# Altium project 电子烟机-KZ-EC06-V1.01.PrjPcb
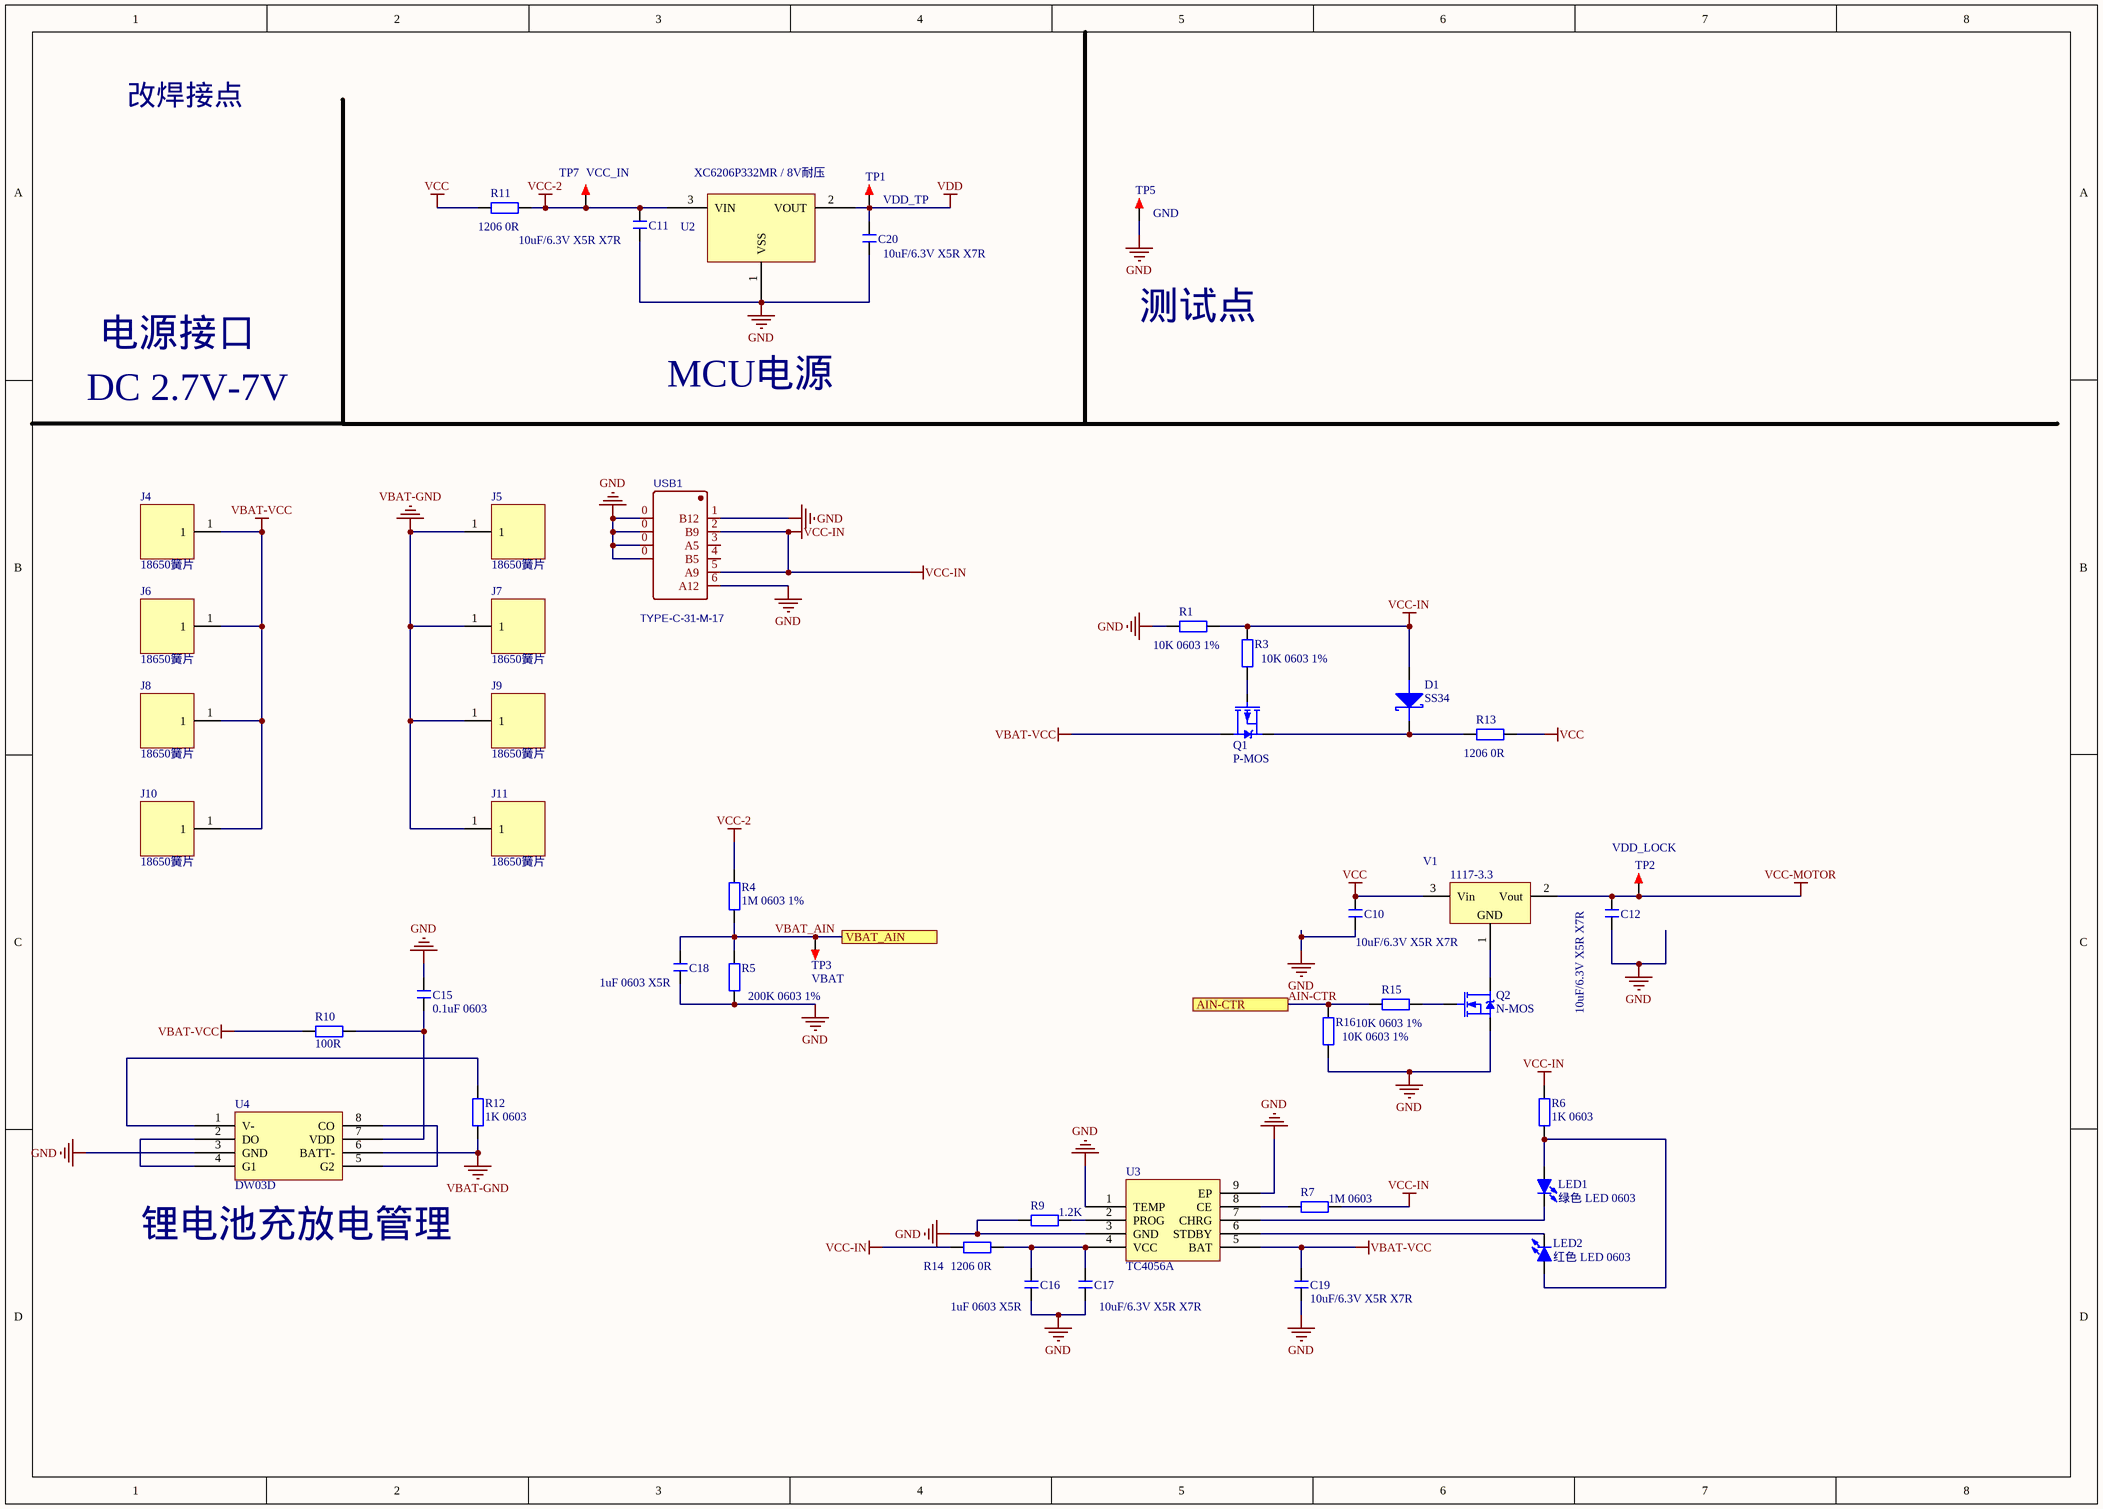
[diagram p0: 电源.SchDoc]
2 sheets, 69 parts. Net scope: flat (ports and power ports of the same name join across sheets).
Board file: BCM-电子烟机-V1.01.PcbDoc
Sheets:
  电源.SchDoc
  主控制器.SchDoc

## Sheet 电源.SchDoc
size A3; Organization: Altium Limited; Address1: L3, 12a Rodborough Rd; Address2: Frenchs Forest; Address3: NSW; Address4: Australia 2086

### Parts
C10  10uF/6.3V X5R X7R  [C 0603]
C11  10uF/6.3V X5R X7R  [C 0603]
C12  10uF/6.3V X5R X7R  [C 0603]
C15  0.1uF 0603  [C 0603]
C16  1uF 0603 X5R  [C 0603]
C17  10uF/6.3V X5R X7R  [C 0603]
C18  1uF 0603 X5R  [C 0603]
C19  10uF/6.3V X5R X7R  [C 0603]
C20  10uF/6.3V X5R X7R  [C 0603]
D1  SS34  [SMA/DO-214AC]
J4  18650簧片  [18650电池簧片]
J5  18650簧片  [18650电池簧片]
J6  18650簧片  [18650电池簧片]
J7  18650簧片  [18650电池簧片]
J8  18650簧片  [18650电池簧片]
J9  18650簧片  [18650电池簧片]
J10  18650簧片  [18650电池簧片]
J11  18650簧片  [18650电池簧片]
LED1  绿色 LED 0603  [LED 0603G]
LED2  红色 LED 0603  [LED 0603G]
Q1  P-MOS  [SOT23]
Q2  N-MOS  [SOT23]
R1  10K 0603 1%  [R 0603]
R3  10K 0603 1%  [R 0603]
R4  1M 0603 1%  [R 0603]
R5  200K 0603 1%  [R 0603]
R6  1K 0603  [R 0603]
R7  1M 0603  [R 0603]
R9  1.2K  [R 0603]
R10  100R  [R 0603]
R11  1206 0R  [R 1206]
R12  1K 0603  [R 0603]
R13  1206 0R  [R 1206]
R14  1206 0R  [R 1206]
R15  10K 0603 1%  [R 0603]
R16  10K 0603 1%  [R 0603]
TP1  VDD_TP  [TEST 1]
TP2  VDD_LOCK  [TEST 1]
TP3  VBAT  [TEST 1]
TP5  GND  [TEST 1]
TP7  VCC_IN  [TEST 1]
U2  XC6206P332MR / 8V耐压  [SOT23-3]
U3  TC4056A  [SOP-8_L4.9-W3.9-P1.27-LS6.0-BL-EP]
U4  DW03D  [TSSOP-8_L4.4-W3.0-P0.65-LS6.4-BL]
USB1  TYPE-C-31-M-17  [USB-TYPE-C-SMD6]
V1  1117-3.3  [SOT223_L]

### Ports
AIN-CTR, VBAT_AIN

### Nets
GND: C10.1 C11.1 C12.1 C15.2 C16.2 C17.2 C18.1 C19.2 C20.1 Q2.S R1.2 R5.1 R9.2 R16.2 TP5.1 U2.1(VSS) U3.1(TEMP) U3.3(GND) U3.9(EP) U4.3(GND) USB1.0 USB1.1(B12) USB1.6(A12)
VBAT-GND: J5.1 J7.1 J9.1 J11.1 R12.1 U4.6(BATT-)
VBAT-VCC: C19.1 J4.1 J6.1 J8.1 J10.1 Q1.D R10.2 U3.5(BAT)
VCC: C10.2 R11.1 R13.2 V1.3(Vin)
VCC-2: C11.2 R4.1 R11.2 TP7.1 U2.3(VIN)
VCC-IN: D1.A R1.1 R3.1 R6.1 R7.1 R14.1 USB1.2(B9) USB1.5(A9)
VCC-MOTOR: C12.2 TP2.1 V1.2(Vout)
VDD: C20.2 TP1.1 U2.2(VOUT)
AIN-CTR: R15.2 R16.1 ; port AIN-CTR
VBAT_AIN: C18.2 R4.2 R5.2 TP3.1 ; port VBAT_AIN
NetC15_1: C15.1 R10.1 U4.7(VDD)
NetC16_1: C16.1 C17.1 R14.2 U3.4(VCC)
NetD1_K: D1.K Q1.S R13.1
NetLED1_1: LED1.1(A) LED2.1(A) R6.2
NetLED1_2: LED1.2(K) U3.7(CHRG)
NetLED2_2: LED2.2(K) U3.6(STDBY)
NetQ1_G: Q1.G R3.2
NetQ2_D: Q2.D V1.1(GND)
NetQ2_G: Q2.G R15.1
NetR7_2: R7.2 U3.8(CE)
NetR9_1: R9.1 U3.2(PROG)
NetR12_2: R12.2 U4.1(V-)
NetU4_2: U4.2(DO) U4.4(G1)
NetU4_5: U4.5(G2) U4.8(CO)

Not connected (* = marked no-connect by the designer): USB1 3(A5) 4(B5)

### Notes on the sheet
- 改焊接点
- 电源接口
- 测试点
- DC 2.7V-7V
- MCU电源
- (near U4) 锂电池充放电管理
- Title
- Size:
- Date:
- A4
- Number:
- Time:
- Revision:
- Sheet
- of
- File:

### Library data of the parts
C10-C12 C15-C20 = C: 无极性贴片电容; 版权归属: 源创客; BOM名称: 无极性贴片电容; 学习资源: www.ooocke.com
D1 = DIODE SCHOTTKY: 肖特基二极管
LED1 LED2 = LED-SMD: 贴片LED; 版权归属: 源创客; BOM名称: 贴片LED; 学习资源: www.ooocke.com
Q1 = P-MOS: P沟道场效应管
Q2 = N-MOS: N沟道场效应管
R1 R3-R7 R9-R16 = R: 贴片电阻; 版权归属: 源创客; BOM名称: 贴片电阻; 学习资源: www.ooocke.com
TP1-TP3 TP5 TP7 = TEST TP: 测试环; 版权归属: 源创客; BOM名称: 测试环; 学习资源: www.ooocke.com
U2 = XC6206P252MR: LDO
U3 = TC4056A: 锂电池充电IC
U4 = DW03D: 充电保护IC
V1 = AMS1117: 三端稳压芯片; BOM名称: 稳压芯片; 版权归属: 源创客; 学习资源: www.ooocke.com

## Sheet 主控制器.SchDoc
size A3; Organization: Altium Limited; Address1: L3, 12a Rodborough Rd; Address2: Frenchs Forest; Address3: NSW; Address4: Australia 2086
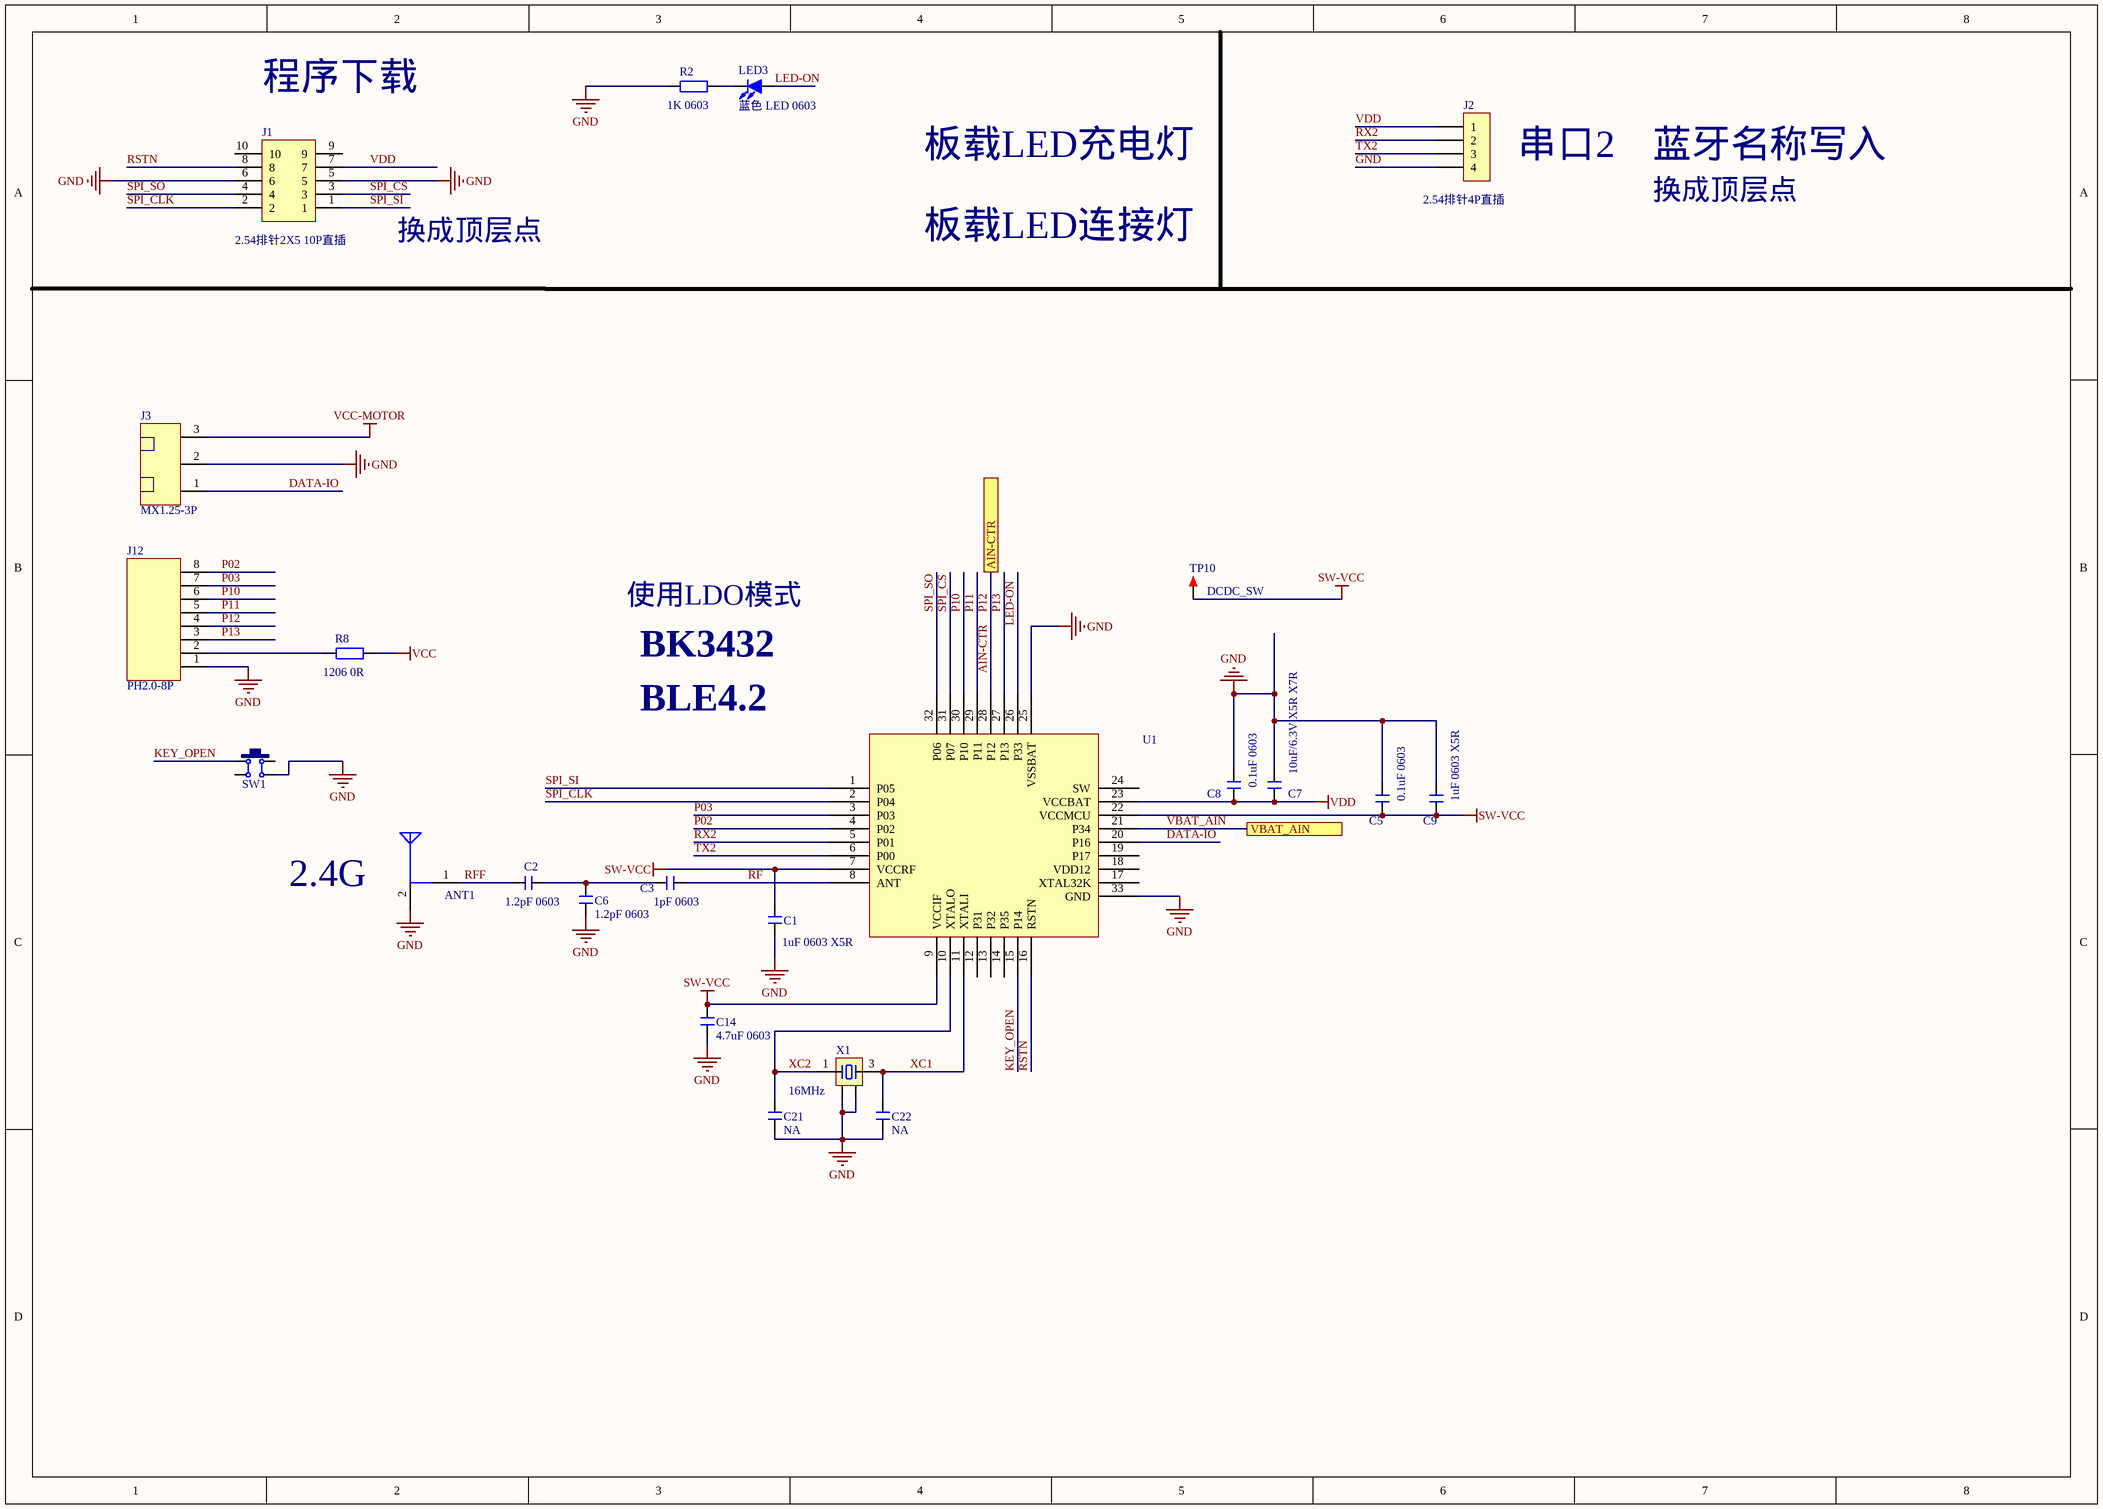
[diagram p1: 主控制器.SchDoc]

### Parts
ANT1  Board_RF  [BK3432-RF-2]  (value not drawn)
C1  1uF 0603 X5R  [C 0603]
C2  1.2pF 0603  [C 0603]
C3  1pF 0603  [C 0603]
C5  0.1uF 0603  [C 0603]
C6  1.2pF 0603  [C 0603]
C7  10uF/6.3V X5R X7R  [C 0603]
C8  0.1uF 0603  [C 0603]
C9  1uF 0603 X5R  [C 0603]
C14  4.7uF 0603  [C 0603]
C21  NA  [C 0603]
C22  NA  [C 0603]
J1  2.54排针2X5 10P直插  [Pin HDR2X5/2.54mm]
J2  2.54排针4P直插  [Pin HDR2.54MM/1X4]
J3  MX1.25-3P  [MX1.25S-3P]
J12  PH2.0-8P  [PH2.0-8P]
LED3  蓝色 LED 0603  [LED 0603G]
R2  1K 0603  [R 0603]
R8  1206 0R  [R 1206]
SW1  6x6x5  [TSW SMD-6*6*4.3]  (value not drawn)
TP10  DCDC_SW  [TEST 1]
U1  BK3432 QFN32  [QFN32]  (value not drawn)
X1  16MHz  [OSC 3225-4P]

### Ports
AIN-CTR, VBAT_AIN

### Nets
GND: C1.1 C5.1 C6.1 C7.1 C8.1 C9.1 C14.1 C21.1 C22.1 J1.5 J1.6 J2.4 J3.2 J12.1 R2.1 SW1.3 U1.25(VSSBAT) U1.33(GND) X1.2 X1.4
SW-VCC: C1.2 C5.2 C9.2 C14.2 TP10.1 U1.7(VCCRF) U1.9(VCCIF) U1.22(VCCMCU)
VCC: R8.2
VCC-MOTOR: J3.3
VDD: C7.2 C8.2 J1.7 J2.1 U1.23(VCCBAT)
AIN-CTR: J12.4 U1.28(P12) ; port AIN-CTR  [also labelled P12]
DATA-IO: J3.1 U1.20(P16)
KEY_OPEN: SW1.1 U1.15(P14)
LED-ON: LED3.1(A) U1.26(P33)
P02: J12.8 U1.4(P02)
P03: J12.7 U1.3(P03)
P10: J12.6 U1.30(P10)
P11: J12.5 U1.29(P11)
P13: J12.3 U1.27(P13)
RF: C3.2 U1.8(ANT)
RFF: ANT1.1(ANT) C2.1
RSTN: J1.8 U1.16(RSTN)
RX2: J2.2 U1.5(P01)
SPI_CLK: J1.2 U1.2(P04)
SPI_CS: J1.3 U1.31(P07)
SPI_SI: J1.1 U1.1(P05)
SPI_SO: J1.4 U1.32(P06)
TX2: J2.3 U1.6(P00)
VBAT_AIN: U1.21(P34) ; port VBAT_AIN
XC1: C22.2 U1.11(XTALI) X1.3
XC2: C21.2 U1.10(XTALO) X1.1
NetC2_2: C2.2 C3.1 C6.2
NetJ12_2: J12.2 R8.1
NetLED3_2: LED3.2(K) R2.2

Not connected (* = marked no-connect by the designer): ANT1 2(GND); J1 9 10; SW1 2 4; U1 12(P31) 13(P32) 14(P35) 17(XTAL32K) 18(VDD12) 19(P17) 24(SW)

### Notes on the sheet
- 程序下载
- 板载LED充电灯
- 串口2
- 蓝牙名称写入
- 换成顶层点
- 板载LED连接灯
- 使用LDO模式
- BK3432
- BLE4.2
- (near ANT1) 2.4G
- Labels drawn without touching a wire or pin: GND
- Title
- Size:
- Date:
- A3
- Number:
- Time:
- Revision:
- Sheet
- of
- File:

### Library data of the parts
ANT1 = SMA-2: SMA-板载2.4G射频天线; 版权归属: 源创客; BOM名称: 板载2.4G射频天线; 学习资源: www.ooocke.com
C1-C3 C5-C9 C14 C21 C22 = C: 无极性贴片电容; 版权归属: 源创客; BOM名称: 无极性贴片电容; 学习资源: www.ooocke.com
J1 = Pin HDR2X5
J2 = Pin HDR1X4
LED3 = LED-SMD: 贴片LED; 版权归属: 源创客; BOM名称: 贴片LED; 学习资源: www.ooocke.com
R2 R8 = R: 贴片电阻; 版权归属: 源创客; BOM名称: 贴片电阻; 学习资源: www.ooocke.com
SW1 = TSW SMD-6x6: 贴片6x6轻触开关; 版权归属: 源创客; BOM名称: 贴片6x6轻触开关; 学习资源: www.ooocke.com
TP10 = TEST TP: 测试环; 版权归属: 源创客; BOM名称: 测试环; 学习资源: www.ooocke.com
X1 = XTAL-4P: 4脚无源晶振

## Nets that join several sheets
GND: 电源 (23 pins), 主控制器 (20 pins)
VCC: 电源 (C10.2 R11.1 R13.2 V1.3), 主控制器 (R8.2)
VCC-MOTOR: 电源 (C12.2 TP2.1 V1.2), 主控制器 (J3.3)
VDD: 电源 (C20.2 TP1.1 U2.2), 主控制器 (5 pins)
AIN-CTR: 电源 (R15.2 R16.1), 主控制器 (J12.4 U1.28)
VBAT_AIN: 电源 (C18.2 R4.2 R5.2 TP3.1), 主控制器 (U1.21)